# Altium schematic sheet Sheet_1_2025-10-18.schdoc
size 209 x 83 mm
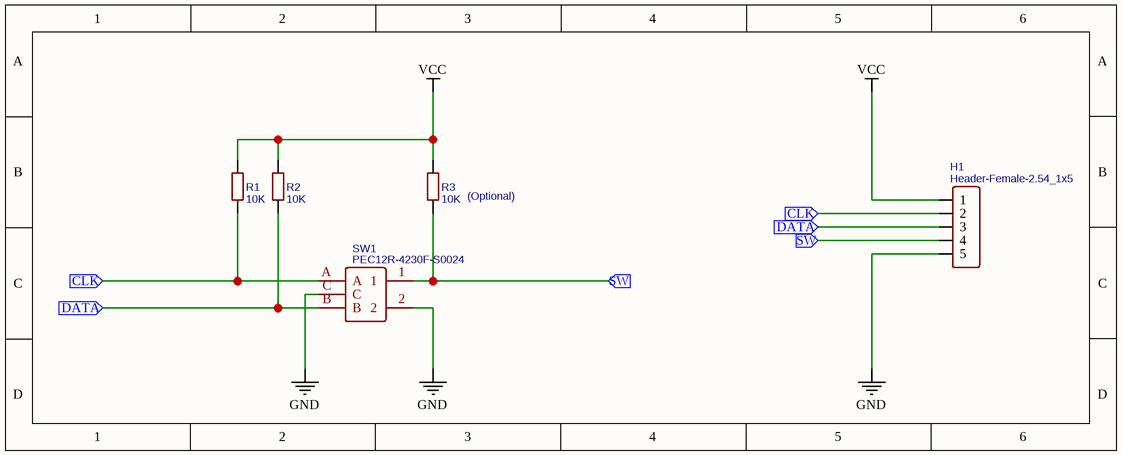
[diagram p0: Sheet_1_2025-10-18.schdoc]

## Parts
H1  Header-Female-2.54_1x5  [HDR-5X1/2.54]
R1  10K  [R1206_1]
R2  10K  [R1206_1]
R3  10K  [R1206_1]
SW1  PEC12R-4230F-S0024  [PEC12R-4230F-S0024]

## Ports
CLK (in), DATA (in), SW (in)

## Nets
GND: H1.5 SW1.2 SW1.C
VCC: H1.1 R1.2 R2.2 R3.2
CLK: H1.2 R1.1 SW1.A ; port CLK
DATA: H1.3 R2.1 SW1.B ; port DATA
SW: H1.4 R3.1 SW1.1 ; port SW

## Notes on the sheet
- (near R3) (Optional)

## Library data of the parts
H1 = Header-Female-2.54_1x5: Manufacturer: BOOMELE; Manufacturer Part: 2.54mm 1*5p Female header; Supplier: LCSC; image: //image.lceda.cn/szlcsc/C50950.jpg; Supplier Part: C50950; spicePre: H
R1-R3 = 10K: Manufacturer: YAGEO; Manufacturer Part: RC0603FR-0710KL; nameAlias: Resistance (Ohms); Supplier: LCSC; Supplier Part: C98220; spicePre: R; spiceSymbolName: RC0603FR-0710KL
SW1 = PEC12R-4230F-S0024: Manufacturer: BOURNS; Contributor: LCSC; Supplier: LCSC; Manufacturer Part: PEC12R-4230F-S0024; Supplier Part: C143818; spicePre: S